# Altium schematic sheet DE1_SIDE_SDRAM.schdoc
size B; SheetNumber: 3; SheetTotal: 3
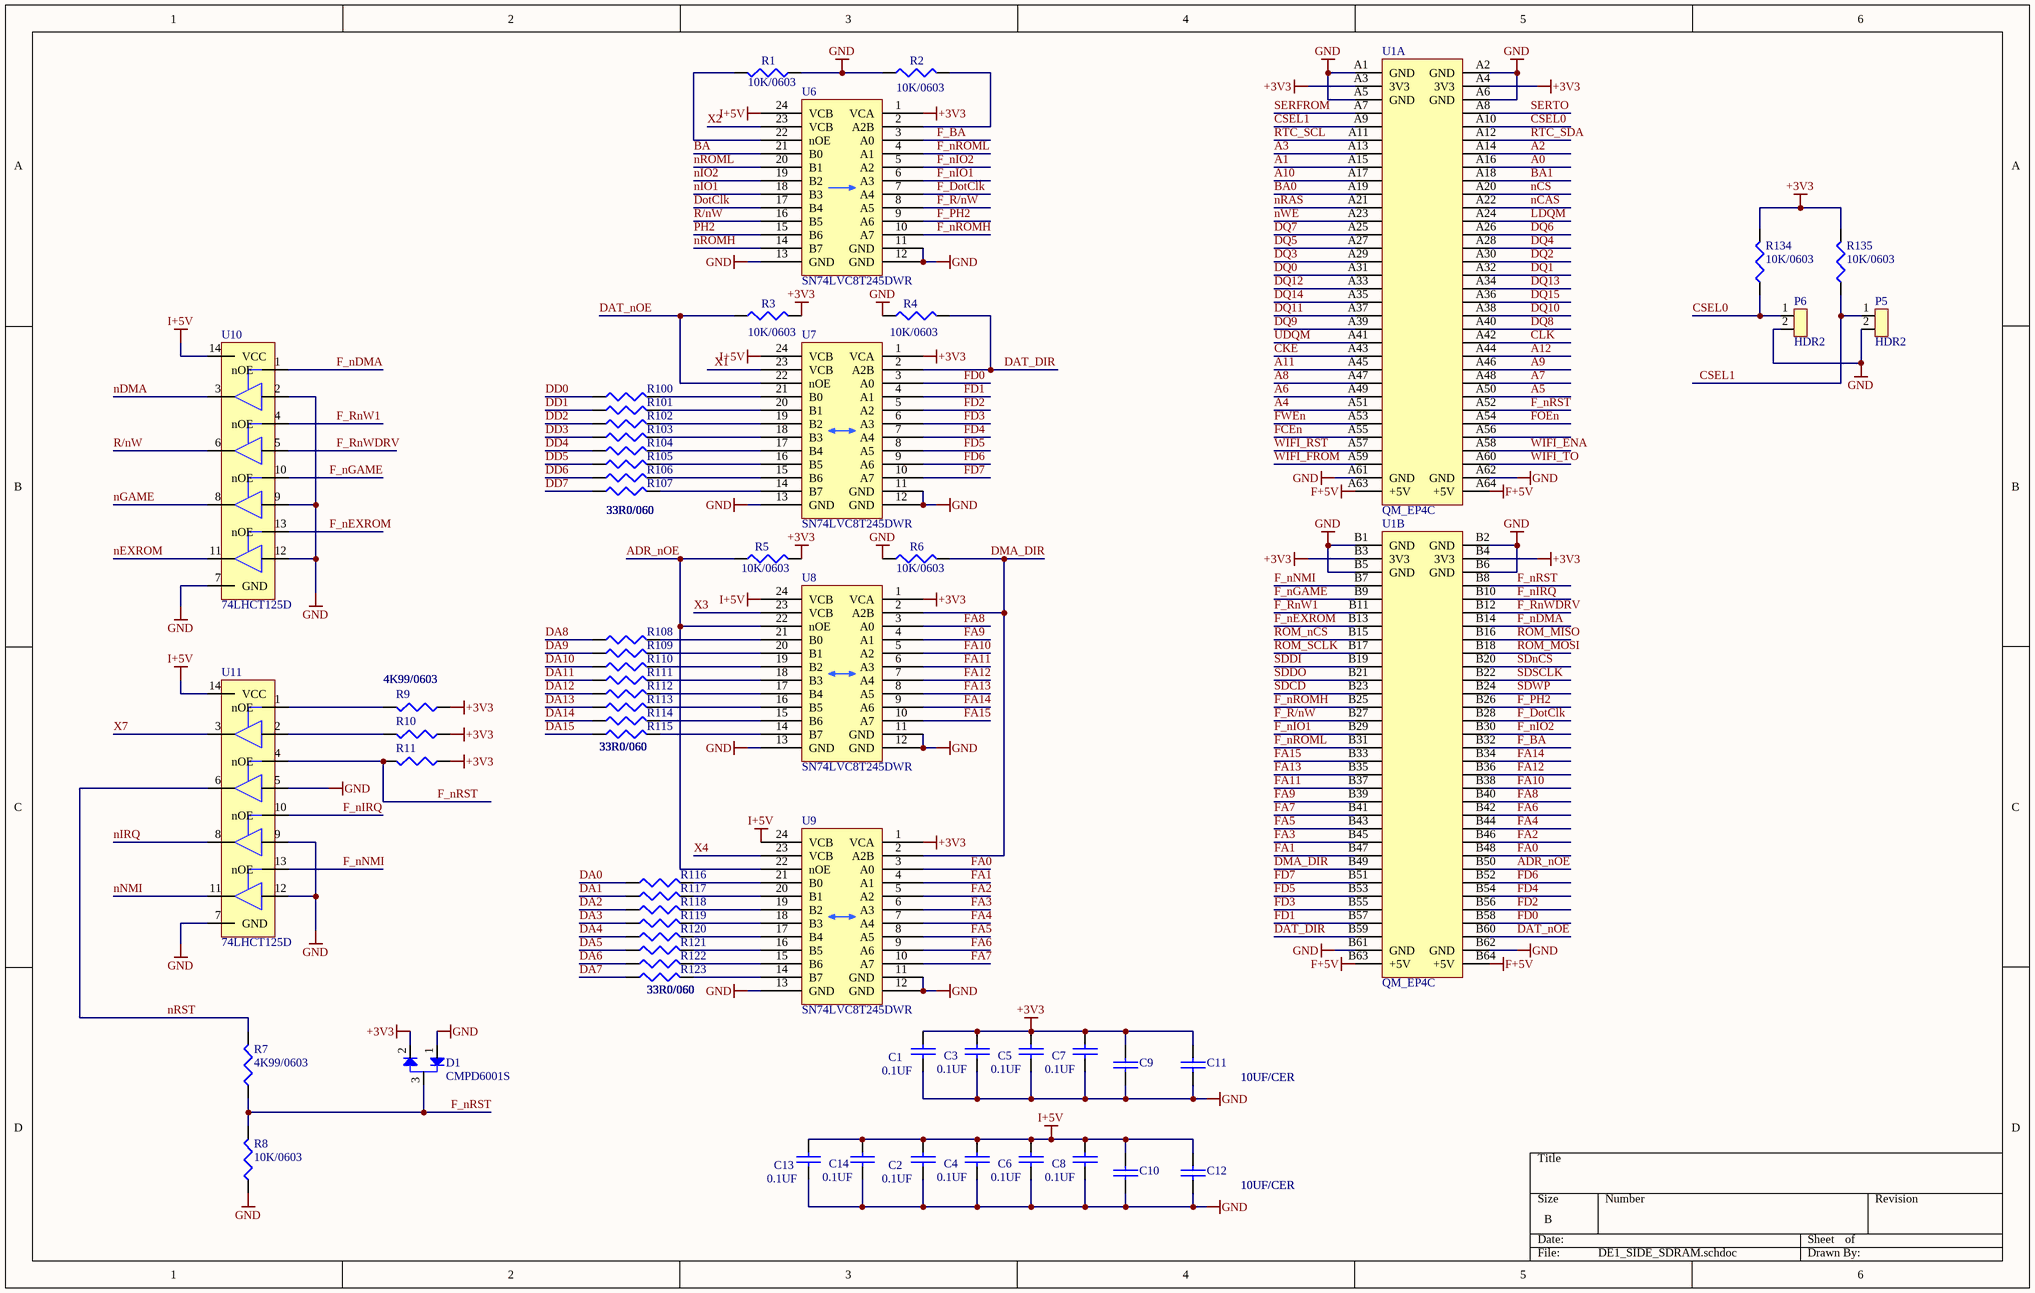
[diagram p0: DE1_SIDE_SDRAM.schdoc]

## Parts
C1  0.1UF  [0603]
C2  0.1UF  [0603]
C3  0.1UF  [0603]
C4  0.1UF  [0603]
C5  0.1UF  [0603]
C6  0.1UF  [0603]
C7  0.1UF  [0603]
C8  0.1UF  [0603]
C9  10UF/CER  [0805]
C10  10UF/CER  [0805]
C11  10UF/CER  [0805]
C12  10UF/CER  [0805]
C13  0.1UF  [0603]
C14  0.1UF  [0603]
D1  CMPD6001S  [SOT-23]
P5  HDR2  [HDR2]
P6  HDR2  [HDR2]
R1  10K/0603  [0603]
R2  10K/0603  [0603]
R3  10K/0603  [0603]
R4  10K/0603  [0603]
R5  10K/0603  [0603]
R6  10K/0603  [0603]
R7  4K99/0603  [0603]
R8  10K/0603  [0603]
R9  4K99/0603  [0603]
R10  4K99/0603  [0603]
R11  4K99/0603  [0603]
R100  33R0/060  [0603]
R101  33R0/060  [0603]
R102  33R0/060  [0603]
R103  33R0/060  [0603]
R104  33R0/060  [0603]
R105  33R0/060  [0603]
R106  33R0/060  [0603]
R107  33R0/060  [0603]
R108  33R0/060  [0603]
R109  33R0/060  [0603]
R110  33R0/060  [0603]
R111  33R0/060  [0603]
R112  33R0/060  [0603]
R113  33R0/060  [0603]
R114  33R0/060  [0603]
R115  33R0/060  [0603]
R116  33R0/060  [0603]
R117  33R0/060  [0603]
R118  33R0/060  [0603]
R119  33R0/060  [0603]
R120  33R0/060  [0603]
R121  33R0/060  [0603]
R122  33R0/060  [0603]
R123  33R0/060  [0603]
R134  10K/0603  [0603]
R135  10K/0603  [0603]
U1  QM_EP4C  [QMTECH_EP4CE15]  (parts A,B of 2)
U6  SN74LVC8T245DWR  [SOL-24]
U7  SN74LVC8T245DWR  [SOL-24]
U8  SN74LVC8T245DWR  [SOL-24]
U9  SN74LVC8T245DWR  [SOL-24]
U10  74LHCT125D  [SOP14]
U11  74LHCT125D  [SOP14]

## Nets
+3V3: C1.1 C3.1 C5.1 C7.1 C9.2 C11.2 D1.2 R3.2 R5.2 R9.1 R10.1 R11.1 R134.2 R135.2 U1.A3(3V3) U1.A4(3V3) U1.B3(3V3) U1.B4(3V3) U6.1(VCA) U7.1(VCA) U8.1(VCA) U9.1(VCA)
F+5V: U1.A63(+5V) U1.A64(+5V) U1.B63(+5V) U1.B64(+5V)
GND: C1.2 C2.2 C3.2 C4.2 C5.2 C6.2 C7.2 C8.2 C9.1 C10.1 C11.1 C12.1 C13.2 C14.2 D1.1 P5.2 P6.2 R1.1 R2.1 R4.1 R6.1 R8.1 U1.A1(GND) U1.A2(GND) U1.A5(GND) U1.A6(GND) U1.A61(GND) U1.A62(GND) U1.B1(GND) U1.B2(GND) U1.B5(GND) U1.B6(GND) U1.B61(GND) U1.B62(GND) U6.11(GND) U6.12(GND) U6.13(GND) U7.11(GND) U7.12(GND) U7.13(GND) U8.11(GND) U8.12(GND) U8.13(GND) U9.11(GND) U9.12(GND) U9.13(GND) U10.2 U10.7(GND) U10.9 U10.12 U11.5 U11.7(GND) U11.9 U11.12
I+5V: C2.1 C4.1 C6.1 C8.1 C10.2 C12.2 C13.1 C14.1 U6.24(VCB) U7.24(VCB) U8.24(VCB) U9.24(VCB) U10.14(VCC) U11.14(VCC)
A0: U1.A16
A1: U1.A15
A2: U1.A14
A3: U1.A13
A4: U1.A51
A5: U1.A50
A6: U1.A49
A7: U1.A48
A8: U1.A47
A9: U1.A46
A10: U1.A17
A11: U1.A45
A12: U1.A44
ADR_nOE: R5.1 U1.B50 U8.22(nOE) U9.22(nOE)
BA: U6.21(B0)
BA0: U1.A19
BA1: U1.A18
CKE: U1.A43
CLK: U1.A42
CSEL0: P6.1 R134.1 U1.A10
CSEL1: P5.1 R135.1 U1.A9
DA0: R116.1
DA1: R117.1
DA2: R118.1
DA3: R119.1
DA4: R120.1
DA5: R121.1
DA6: R122.1
DA7: R123.1
DA8: R108.1
DA9: R109.1
DA10: R110.1
DA11: R111.1
DA12: R112.1
DA13: R113.1
DA14: R114.1
DA15: R115.1
DAT_DIR: R4.2 U1.B59 U7.2(A2B)
DAT_nOE: R3.1 U1.B60 U7.22(nOE)
DD0: R100.1
DD1: R101.1
DD2: R102.1
DD3: R103.1
DD4: R104.1
DD5: R105.1
DD6: R106.1
DD7: R107.1
DMA_DIR: R6.2 U1.B49 U8.2(A2B) U9.2(A2B)
DotClk: U6.17(B4)
DQ0: U1.A31
DQ1: U1.A32
DQ2: U1.A30
DQ3: U1.A29
DQ4: U1.A28
DQ5: U1.A27
DQ6: U1.A26
DQ7: U1.A25
DQ8: U1.A40
DQ9: U1.A39
DQ10: U1.A38
DQ11: U1.A37
DQ12: U1.A33
DQ13: U1.A34
DQ14: U1.A35
DQ15: U1.A36
F_BA: U1.B32 U6.3(A0)
F_DotClk: U1.B28 U6.7(A4)
F_nDMA: U1.B14 U10.1(nOE)
F_nEXROM: U1.B13 U10.13(nOE)
F_nGAME: U1.B9 U10.10(nOE)
F_nIO1: U1.B29 U6.6(A3)
F_nIO2: U1.B30 U6.5(A2)
F_nIRQ: U1.B10 U11.10(nOE)
F_nNMI: U1.B7 U11.13(nOE)
F_nROMH: U1.B25 U6.10(A7)
F_nROML: U1.B31 U6.4(A1)
F_nRST: D1.3 R7.1 R8.2 R11.2 U1.A52 U1.B8 U11.4(nOE)
F_PH2: U1.B26 U6.9(A6)
F_R/nW: U1.B27 U6.8(A5)
F_RnW1: U1.B11 U10.4(nOE)
F_RnWDRV: U1.B12 U10.5
FA0: U1.B48 U9.3(A0)
FA1: U1.B47 U9.4(A1)
FA2: U1.B46 U9.5(A2)
FA3: U1.B45 U9.6(A3)
FA4: U1.B44 U9.7(A4)
FA5: U1.B43 U9.8(A5)
FA6: U1.B42 U9.9(A6)
FA7: U1.B41 U9.10(A7)
FA8: U1.B40 U8.3(A0)
FA9: U1.B39 U8.4(A1)
FA10: U1.B38 U8.5(A2)
FA11: U1.B37 U8.6(A3)
FA12: U1.B36 U8.7(A4)
FA13: U1.B35 U8.8(A5)
FA14: U1.B34 U8.9(A6)
FA15: U1.B33 U8.10(A7)
FCEn: U1.A55
FD0: U1.B58 U7.3(A0)
FD1: U1.B57 U7.4(A1)
FD2: U1.B56 U7.5(A2)
FD3: U1.B55 U7.6(A3)
FD4: U1.B54 U7.7(A4)
FD5: U1.B53 U7.8(A5)
FD6: U1.B52 U7.9(A6)
FD7: U1.B51 U7.10(A7)
FOEn: U1.A54
FWEn: U1.A53
LDQM: U1.A24
nCAS: U1.A22
nCS: U1.A20
nDMA: U10.3
nEXROM: U10.11
nGAME: U10.8
nIO1: U6.18(B3)
nIO2: U6.19(B2)
nIRQ: U11.8
nNMI: U11.11
nRAS: U1.A21
nROMH: U6.14(B7)
nROML: U6.20(B1)
nRST: R7.2 U11.6
nWE: U1.A23
PH2: U6.15(B6)
R/nW: U6.16(B5) U10.6
ROM_MISO: U1.B16
ROM_MOSI: U1.B18
ROM_nCS: U1.B15
ROM_SCLK: U1.B17
RTC_SCL: U1.A11
RTC_SDA: U1.A12
SDCD: U1.B23
SDDI: U1.B19
SDDO: U1.B21
SDnCS: U1.B20
SDSCLK: U1.B22
SDWP: U1.B24
SERFROM: U1.A7
SERTO: U1.A8
UDQM: U1.A41
WIFI_ENA: U1.A58
WIFI_FROM: U1.A59
WIFI_RST: U1.A57
WIFI_TO: U1.A60
X1: U7.23(VCB)
X2: U6.23(VCB)
X3: U8.23(VCB)
X4: U9.23(VCB)
X7: U11.3
NetR1_2: R1.2 U6.22(nOE)
NetR2_2: R2.2 U6.2(A2B)
NetR9_2: R9.2 U11.1(nOE)
NetR10_2: R10.2 U11.2
NetR100_2: R100.2 U7.21(B0)
NetR101_2: R101.2 U7.20(B1)
NetR102_2: R102.2 U7.19(B2)
NetR103_2: R103.2 U7.18(B3)
NetR104_2: R104.2 U7.17(B4)
NetR105_2: R105.2 U7.16(B5)
NetR106_2: R106.2 U7.15(B6)
NetR107_2: R107.2 U7.14(B7)
NetR108_2: R108.2 U8.21(B0)
NetR109_2: R109.2 U8.20(B1)
NetR110_2: R110.2 U8.19(B2)
NetR111_2: R111.2 U8.18(B3)
NetR112_2: R112.2 U8.17(B4)
NetR113_2: R113.2 U8.16(B5)
NetR114_2: R114.2 U8.15(B6)
NetR115_2: R115.2 U8.14(B7)
NetR116_2: R116.2 U9.21(B0)
NetR117_2: R117.2 U9.20(B1)
NetR118_2: R118.2 U9.19(B2)
NetR119_2: R119.2 U9.18(B3)
NetR120_2: R120.2 U9.17(B4)
NetR121_2: R121.2 U9.16(B5)
NetR122_2: R122.2 U9.15(B6)
NetR123_2: R123.2 U9.14(B7)

Not connected (* = marked no-connect by the designer): U1 A56

## Library data of the parts
C1-C8 C13 C14 = 0.1UF: CAP .10UF 16V CERAMIC X7R 0603; Text Field1: Kemet; Text Field2: C0603C104K4RACTU; Text Field3: 399-1096-1-ND; Text Field4: 1.17
C9-C12 = 10UF/CER: 10µF ±10% 25V Ceramic Capacitor X7S 0805; Text Field1: Murata; Text Field2: GRM21BC71E106KE11L; Text Field3: 490-10496-1-ND
D1 = CMPD6001S: Diode Array 1 Pair Series Connection Standard 75V 250mA Surface Mount TO-236-3, SC-59, SOT-23-3; MFG PN: CMPD6001S TR; DK PN: CMPD6001S CT-ND; MFG: Central Semiconductor; FOOTPRINT: SOT23; Populate: *
R1-R6 = 10K/0603: RES 10.0K OHM 1/10W 1% 0603 SMD; Text Field1: Dale/Vishay; Text Field2: CRCW060310K0FKEA; Text Field3: 541-10.0KHCT-ND; Text Field4: 5.02
R7 R9-R11 = 4K99/0603: RES 4.99K OHM 1/10W 1% 0603 SMD; MFG: Dale/Vishay; MFG PN: CRCW06034K99FKEAC; DK PN: 541-3985-1-ND; Price: 5.02
R8 R134 R135 = 10K/0603: RES 10.0K OHM 1/10W 1% 0603 SMD; MFG: Dale/Vishay; MFG PN: CRCW060310K0FKEA; DK PN: 541-10.0KHCT-ND; Price: 5.02
R100-R123 = 33R0/060: 33 Ohms ±1% 0.1W, 1/10W Chip Resistor 0603 (1608 Metric) Moisture Resistant Thick Film; MFG: Yaego; MFG PN: RC0603FR-0733RL; DK PN: 311-33.0HRCT-ND
U6-U9 = SN74LVC8T245DWR: Voltage Level Translator Bidirectional 1 Circuit 8 Channel 24-SOIC; MFG: TI; DK PN: 296-23280-1-ND; MFG PN: SN74LVC8T245DWR; Price: 1.02
U10 U11 = 74LHCT125D: Buffer, Non-Inverting 4 Element 1 Bit per Element 3-State Output 14-SOIC; MFG: Nexpiria; MFG PN: 74HCT125D,653; DK PN: 1727-2834-2-ND; Price: 1.17